# EAGLE design 5p_06052018 (EAGLE 6.6.0)
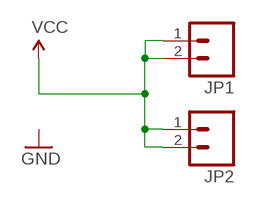
[diagram p0: schematic, sheet 1]

## Parts
JP1  M02-JST-2-PTH-NO_SILK  [JST-2-PTH-NS]
JP2  M02-JST-2-PTH-NO_SILK  [JST-2-PTH-NS]

## Nets
VCC: JP1.1 JP1.2 JP2.1 JP2.2

## Library data of the parts
JP1 JP2 = SparkFun-Connectors:M02: Header 2 Standard 2-pin 0.1" header. Use with straight break away headers (SKU : PRT-00116), right angle break away headers (PRT-00553), swiss pins (PRT-00743), machine pins (PRT-00117), and female headers (PRT-00115). Molex polarized connector foot print use with SKU : PRT-08233 with associated crimp pins and housings.

## Board
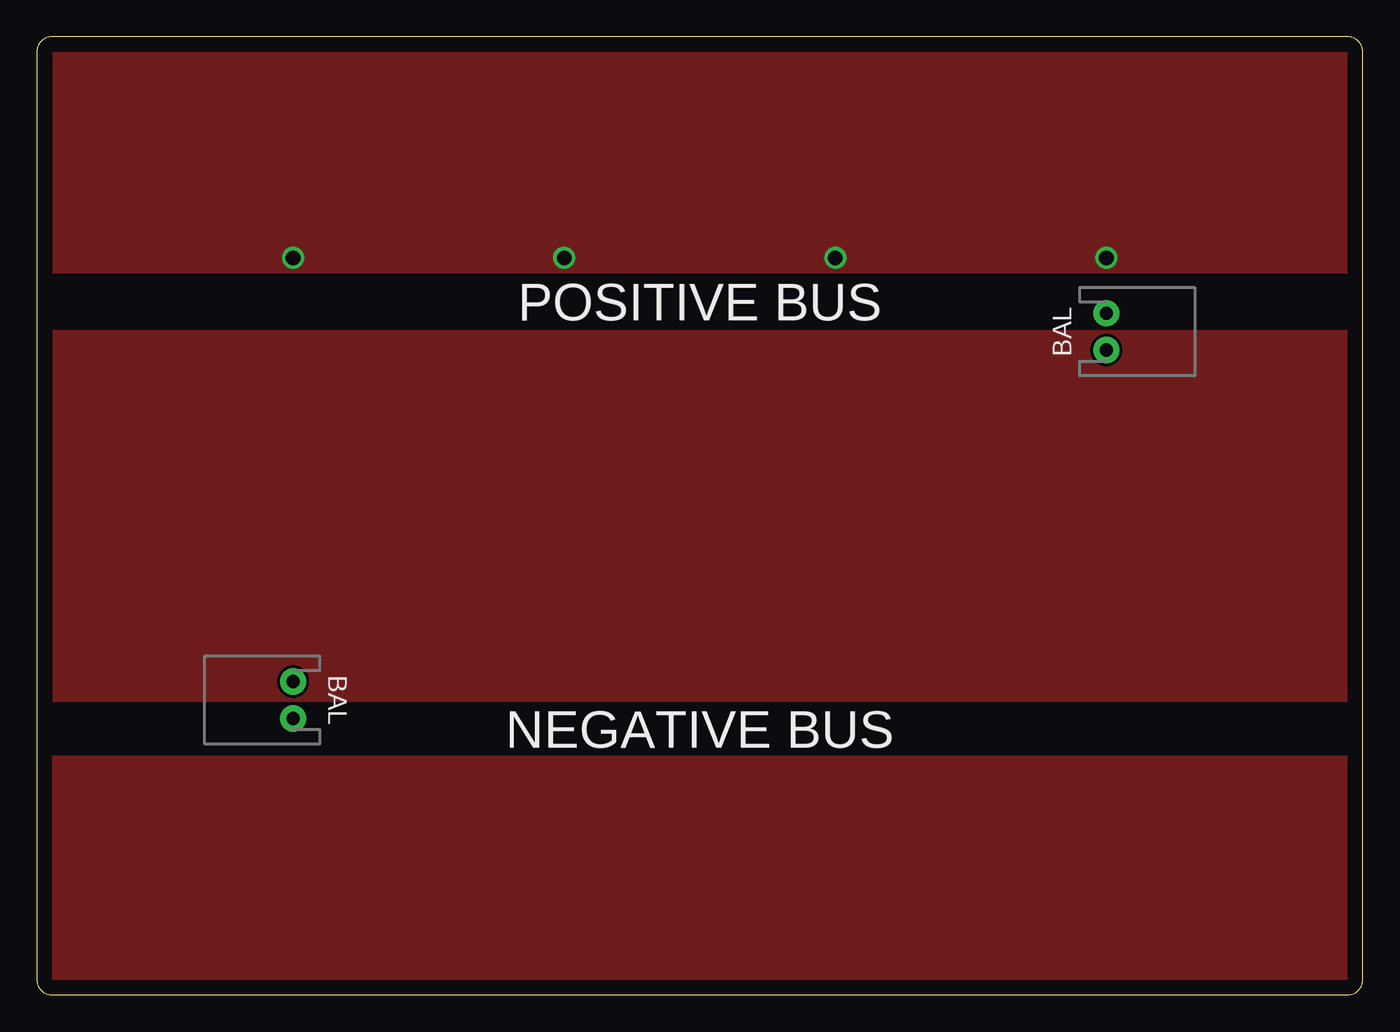
[diagram p1: board, top side]
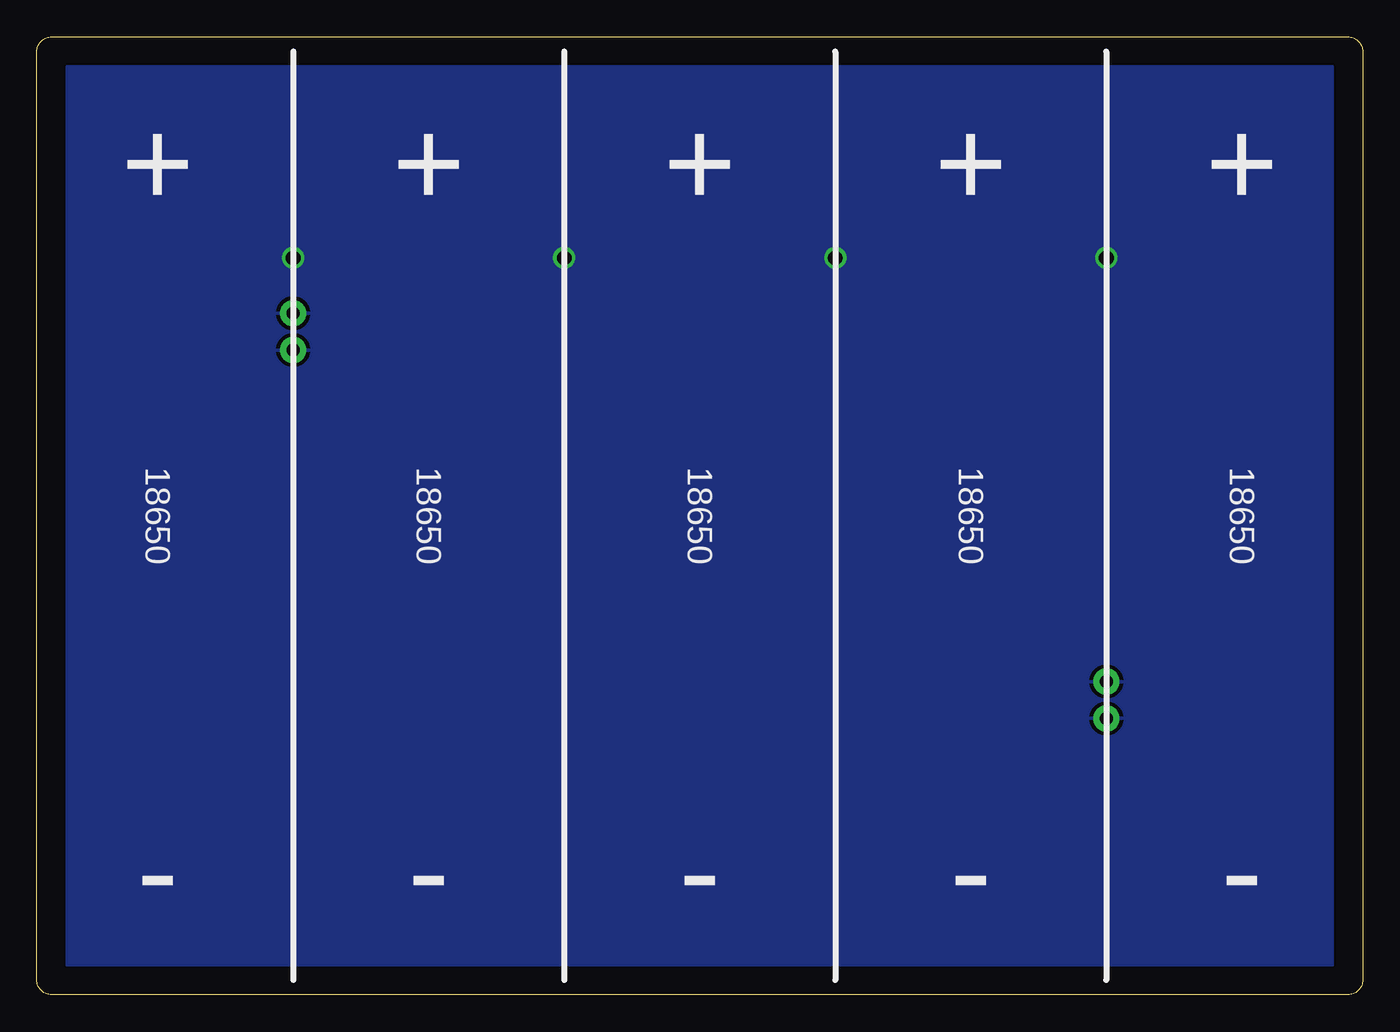
[diagram p2: board, bottom side, seen from below]

Size 90 x 65 mm. Coordinates in mm from the lower left corner, seen from the top.
Outline: 1,0 89,0 arc90 90,1 90,64 arc90 89,65 1,65 arc90 0,64 0,1 arc90 1,0
Copper layers (1*16): Top 0.035mm / dielectric 1.5mm / Bottom 0.035mm
Design rules "default": minimum track width 10mil, minimum drill 24mil, track to track 8mil, track to pad 8mil, pad to pad 8mil, via to via 8mil, smd to smd 8mil, copper to edge 40mil, drill to drill 8mil, minimum pad ring 10mil, minimum via ring 8mil, stop-mask expansion 4mil, vias tented up to drill 0mil, thermal gap 10mil

### Footprints (pad centres in the part's own frame; a part is rotated, then mirrored left to right if it is on the bottom)
JST-2-PTH-NS = drill 0.9 pad 1.778: 1 -1.25,0; 2 1.25,0

### Placement (x,y rotation side)
JP1  72.6,45 270 top
JP2  17.4,20 90 top

### Tracks (layer width: path | path; a pad name or v marks a point on that pad's centre or on a via)
GND
  pour Top: 0,0 90,0 90,16 0,16
  pour Top: 1,45 1,20 89,20 89,45
VCC  (via drill 1)
  other vias: 17.4,50 72.6,50 35.8,50 54.2,50
  pour Bottom: 2,63 88,63 88,2 2,2
  pour Top: 1,64 89,64 89,49 1,49

### Text on the board
bPlace: + | + | + | + | + | - | - | - | - | -
tNames: POSITIVE BUS | BAL | BAL | NEGATIVE BUS
bNames: 18650 | 18650 | 18650 | 18650 | 18650